# Altium schematic sheet BuckConverter.SchDoc
size A2; DrawnBy: Alexey Savchenko; Organization: Ring; Revision: 1.0
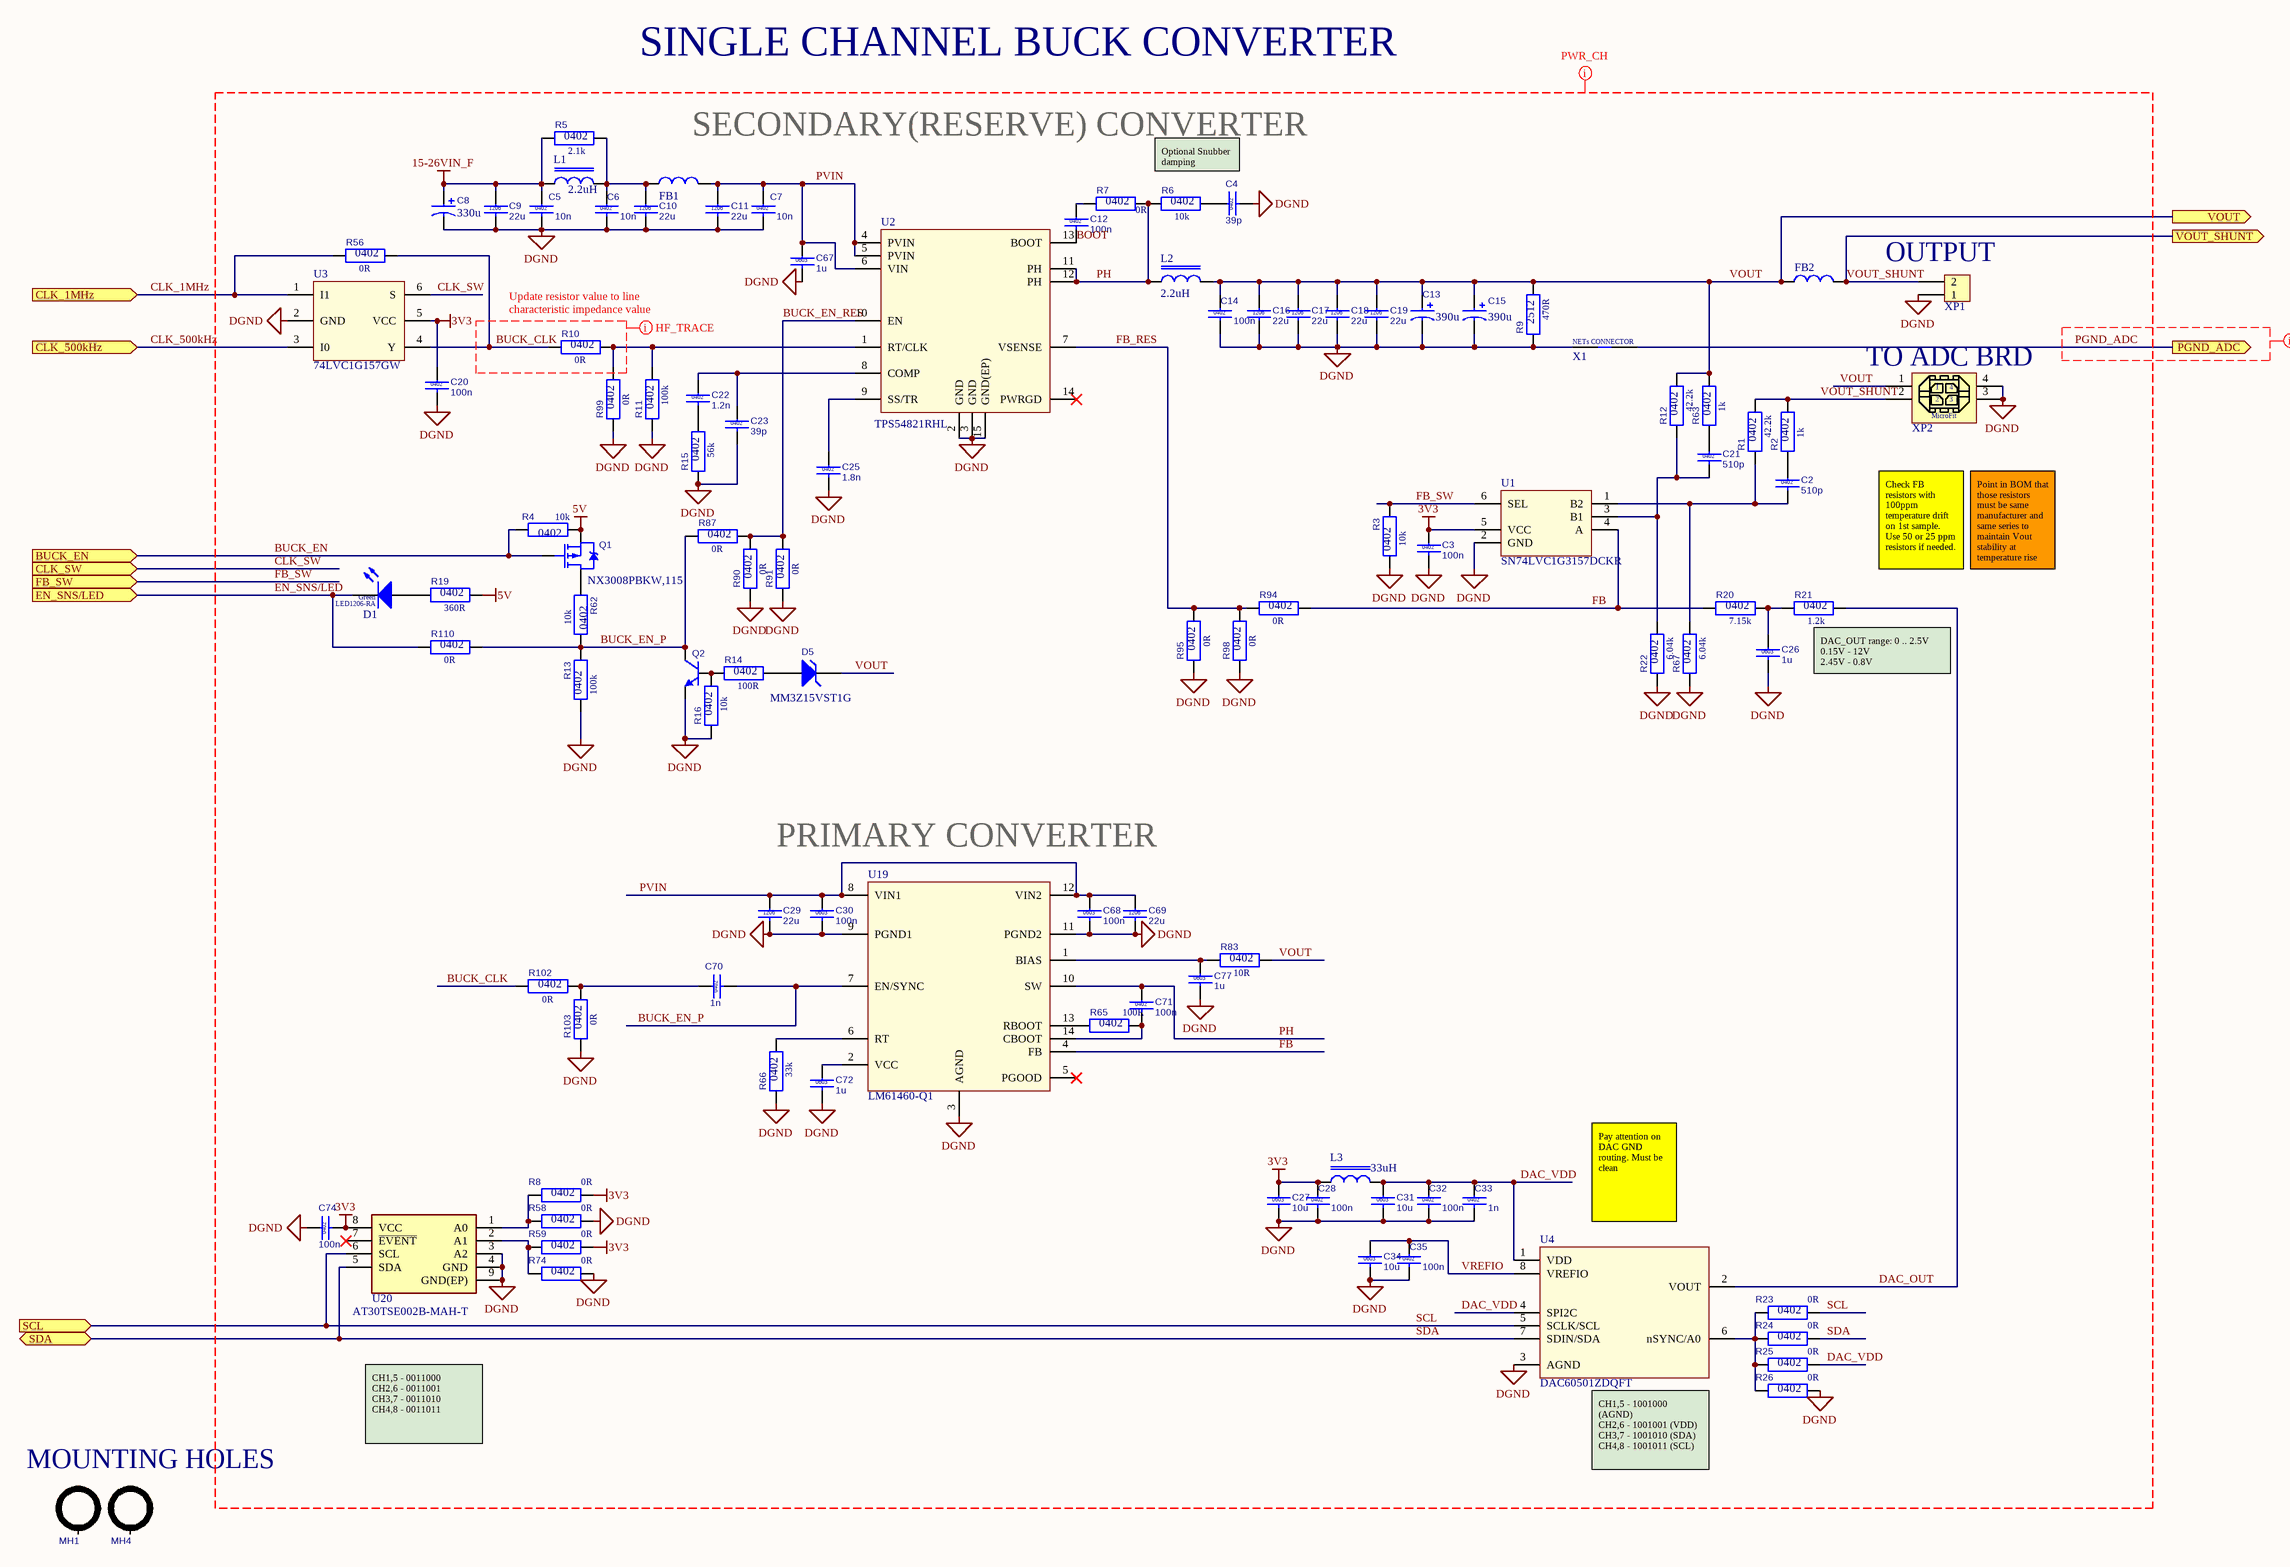
[diagram p0: BuckConverter.SchDoc]

## Parts
C2  510p  Case: 0402  [CC0402M]
C3  100n  Case: 0402  [CC0402M]
C4  39p  Case: 0402  [CC0402M]
C5  10n  Case: 0402  [CC0603M]
C6  10n  Case: 0402  [CC0603M]
C7  10n  Case: 0402  [CC0603M]
C8  330u  [CA-D10H10.5-SMD]
C9  22u  Case: 1206  [CC1206M]
C10  22u  Case: 1206  [CC1206M]
C11  22u  Case: 1206  [CC1206M]
C12  100n  Case: 0402  [CC0402M]
C13  390u  [CA-D8H12-SMD]
C14  100n  Case: 0402  [CC0402M]
C15  390u  [CA-D8H12-SMD]
C16  22u  Case: 1206  [CC1206M]
C17  22u  Case: 1206  [CC1206M]
C18  22u  Case: 1206  [CC1206M]
C19  22u  Case: 1206  [CC1206M]
C20  100n  Case: 0402  [CC0402M]
C21  510p  Case: 0402  [CC0402M]
C22  1.2n  Case: 0402  [CC0402M]
C23  39p  Case: 0402  [CC0402M]
C25  1.8n  Case: 0402  [CC0402M]
C26  1u  Case: 0603  [CC0603M]
C27  10u  Case: 0603  [CC0603M]
C28  100n  Case: 0402  [CC0402M]
C29  22u  Case: 1206  [CC1206M]
C30  100n  Case: 0603  [CC0603M]
C31  10u  Case: 0603  [CC0603M]
C32  100n  Case: 0402  [CC0402M]
C33  1n  Case: 0402  [CC0402M]
C34  10u  Case: 0603  [CC0603M]
C35  100n  Case: 0402  [CC0402M]
C67  1u  Case: 0603  [CC0603M]
C68  100n  Case: 0603  [CC0603M]
C69  22u  Case: 1206  [CC1206M]
C70  1n  Case: 0402  [CC0402M]
C71  100n  Case: 0402  [CC0402M]
C72  1u  Case: 0603  [CC0603M]
C74  100n  Case: 0402  [CC0402M]
C77  1u  Case: 0603  [CC0603M]
D1  Color: Green  [LED1206-RA]  (hidden comment: 155124GS73200A)
D5  MM3Z15VST1G  [SOD323]
FB1  BLM21SP601SH1D  [FB0805M]  (value not drawn)
FB2  BLM18KG260TN1D  [FB0603M]  (value not drawn)
L1  2.2uH  [MGV252010S]
L2  2.2uH  [104CDMCCDS]
L3  33uH  [IC0805-M]
MH1  MH-3.5-PLATED  [MH_3.5_PLATED]  (value not drawn)  (no BOM)
MH4  MH-3.5-PLATED  [MH_3.5_PLATED]  (value not drawn)  (no BOM)
Q1  NX3008PBKW,115  [SOT323]
Q2  NPN_transistor_SOT23-3  [SOT323]  (value not drawn)
R1  Case: 0402  [RC0402M]  (hidden comment: 42.2k)
R2  Case: 0402  [RC0402M]  (hidden comment: 1k)
R3  Case: 0402  [RC0402M]  (hidden comment: 10k)
R4  Case: 0402  [RC0402M]  (hidden comment: 10k)
R5  Case: 0402  [RC0402M]  (hidden comment: 2.1k)
R6  Case: 0402  [RC0402M]  (hidden comment: 10k)
R7  Case: 0402  [RC0402M]  (hidden comment: 0R)
R8  Case: 0402  [RC0402M]  (hidden comment: 0R)
R9  Case: 2512  [RC2512M]  (hidden comment: 470R)
R10  Case: 0402  [RC0402M]  (hidden comment: 0R)
R11  Case: 0402  [RC0402M]  (hidden comment: 100k)
R12  Case: 0402  [RC0402M]  (hidden comment: 42.2k)
R13  Case: 0402  [RC0402M]  (hidden comment: 100k)
R14  Case: 0402  [RC0402M]  (hidden comment: 100R)
R15  Case: 0402  [RC0402M]  (hidden comment: 56k)
R16  Case: 0402  [RC0402M]  (hidden comment: 10k)
R19  Case: 0402  [RC0402M]  (hidden comment: 360R)
R20  Case: 0402  [RC0402M]  (hidden comment: 7.15k)
R21  Case: 0402  [RC0402M]  (hidden comment: 1.2k)
R22  Case: 0402  [RC0402M]  (hidden comment: 6.04k)
R23  Case: 0402  [RC0402M]  (hidden comment: 0R)
R24  Case: 0402  [RC0402M]  (hidden comment: 0R)
R25  Case: 0402  [RC0402M]  (hidden comment: 0R)
R26  Case: 0402  [RC0402M]  (hidden comment: 0R)
R56  Case: 0402  [RC0402M]  (hidden comment: 0R)
R58  Case: 0402  [RC0402M]  (hidden comment: 0R)
R59  Case: 0402  [RC0402M]  (hidden comment: 0R)
R62  Case: 0402  [RC0402M]  (hidden comment: 10k)
R63  Case: 0402  [RC0402M]  (hidden comment: 1k)
R65  Case: 0402  [RC0402M]  (hidden comment: 100R)
R66  Case: 0402  [RC0402M]  (hidden comment: 33k)
R67  Case: 0402  [RC0402M]  (hidden comment: 6.04k)
R74  Case: 0402  [RC0402M]  (hidden comment: 0R)
R83  Case: 0402  [RC0402M]  (hidden comment: 10R)
R87  Case: 0402  [RC0402M]  (hidden comment: 0R)
R90  Case: 0402  [RC0402M]  (hidden comment: 0R)
R91  Case: 0402  [RC0402M]  (hidden comment: 0R)
R94  Case: 0402  [RC0402M]  (hidden comment: 0R)
R95  Case: 0402  [RC0402M]  (hidden comment: 0R)
R98  Case: 0402  [RC0402M]  (hidden comment: 0R)
R99  Case: 0402  [RC0402M]  (hidden comment: 0R)
R102  Case: 0402  [RC0402M]  (hidden comment: 0R)
R103  Case: 0402  [RC0402M]  (hidden comment: 0R)
R110  Case: 0402  [RC0402M]  (hidden comment: 0R)
U1  SN74LVC1G3157DCKR  [SOT363]
U2  TPS54821RHL  [VQFN-14]
U3  74LVC1G157GW  [SOT363]
U4  DAC60501ZDQFT  [WSON-8]
U19  LM61460-Q1  [VQFN-HR-14]
U20  AT30TSE002B-MAH-T  [WDFN-8]
X1  NETs_CONNECTOR  [NETs_CONNECTOR]  (value not drawn)  (no BOM)
XP1  TBH-2x3.81P-RA-GN  [TBH-2x3.81P-RA-GN]  (value not drawn)
XP2  0447690401  [0447690401]  (value not drawn)

## Ports
BUCK_EN (in), CLK_1MHz (in), CLK_500kHz (in), CLK_SW (in), EN_SNS/LED (in), FB_SW (in), PGND_ADC (out), SCL (in), SDA (bidir), VOUT (out), VOUT_SHUNT (out)

## Nets
3V3: C3.1 C20.1 C27.1 C28.1 C74.2 L3.1 R8.2 R59.2 U1.5(VCC) U3.5(VCC) U20.8(VCC)
5V: Q1.2(S) R4.2 R19.2
15-26VIN_F: C5.1 C8.1 C9.1 L1.1 R5.1
DGND: C3.2 C4.2 C5.2 C6.2 C7.2 C8.2 C9.2 C10.2 C11.2 C13.2 C14.2 C15.2 C16.2 C17.2 C18.2 C19.2 C20.2 C23.2 C25.2 C26.2 C27.2 C28.2 C29.2 C30.2 C31.2 C32.2 C33.2 C34.2 C35.2 C67.2 C68.2 C69.2 C72.2 C74.1 C77.2 Q2.2(E) R3.2 R9.1 R11.1 R13.2 R15.1 R16.1 R22.1 R26.2 R58.2 R66.1 R67.1 R74.2 R90.1 R91.1 R95.1 R98.1 R99.1 R103.1 U1.2(GND) U2.2(GND) U2.3(GND) U2.15(GND(EP)) U3.2(GND) U4.3(AGND) U19.3(AGND) U19.9(PGND1) U19.11(PGND2) U20.3(A2) U20.4(GND) U20.9(GND(EP)) X1.1 XP1.1 XP2.3 XP2.4
BOOT: C12.2 U2.13(BOOT)
BUCK_CLK: R10.1 R56.2 R102.1 U3.4(Y)
BUCK_EN: Q1.1(G) R4.1 ; port BUCK_EN
BUCK_EN_P: C70.2 Q2.3(C) R13.1 R62.2 R87.1 R110.2 U19.7(EN/SYNC)
BUCK_EN_RES: R87.2 R90.2 R91.2 U2.10(EN)
CLK_1MHz: R56.1 U3.1(I1) ; port CLK_1MHz
CLK_500kHz: U3.3(I0) ; port CLK_500kHz
CLK_SW: U3.6(S) ; port CLK_SW
DAC_OUT: R21.2 U4.2(VOUT)
DAC_VDD: C31.1 C32.1 C33.1 L3.2 R25.2 U4.1(VDD) U4.4(SPI2C)
EN_SNS/LED: D1.1(K) R110.1 ; port EN_SNS/LED
FB: R20.1 R94.2 U1.4(A) U19.4(FB)
FB_RES: R94.1 R95.2 R98.2 U2.7(VSENSE)
FB_SW: R3.1 U1.6(SEL) ; port FB_SW
PGND_ADC: X1.2 ; port PGND_ADC
PH: C71.1 L2.1 R6.1 R7.2 U2.11(PH) U2.12(PH) U19.10(SW)
PVIN: C7.1 C11.1 C29.1 C30.1 C67.1 C68.1 C69.1 FB1.2 U2.4(PVIN) U2.5(PVIN) U2.6(VIN) U19.8(VIN1) U19.12(VIN2)
SCL: R23.2 U4.5(SCLK/SCL) U20.6(SCL) ; port SCL
SDA: R24.2 U4.7(SDIN/SDA) U20.5(SDA) ; port SDA
VOUT: C13.1 C14.1 C15.1 C16.1 C17.1 C18.1 C19.1 D5.1(K) FB2.1 L2.2 R9.2 R12.2 R63.2 R83.2 XP2.1 ; port VOUT
VOUT_SHUNT: FB2.2 R1.2 R2.2 XP1.2 XP2.2 ; port VOUT_SHUNT
VREFIO: C34.1 C35.1 U4.8(VREFIO)
NetC2_1: C2.1 R2.1
NetC2_2: C2.2 R1.1 R67.2 U1.1(B2)
NetC4_1: C4.1 R6.2
NetC6_1: C6.1 C10.1 FB1.1 L1.2 R5.2
NetC12_1: C12.1 R7.1
NetC21_1: C21.1 R63.1
NetC21_2: C21.2 R12.1 R22.2 U1.3(B1)
NetC22_1: C22.1 C23.1 U2.8(COMP)
NetC22_2: C22.2 R15.2
NetC25_1: C25.1 U2.9(SS/TR)
NetC26_1: C26.1 R20.2 R21.1
NetC70_1: C70.1 R102.2 R103.2
NetC71_2: C71.2 R65.2 U19.14(CBOOT)
NetC72_1: C72.1 U19.2(VCC)
NetC77_1: C77.1 R83.1 U19.1(BIAS)
NetD1_2: D1.2(A) R19.1
NetD5_2: D5.2(A) R14.2
NetQ1_3: Q1.3(D) R62.1
NetQ2_1: Q2.1(B) R14.1 R16.2
NetR8_1: R8.1 R58.1 U20.1(A0)
NetR10_2: R10.2 R11.2 R99.2 U2.1(RT/CLK)
NetR23_1: R23.1 R24.1 R25.1 R26.1 U4.6(nSYNC/A0)
NetR59_1: R59.1 R74.1 U20.2(A1)
NetR65_1: R65.1 U19.13(RBOOT)
NetR66_2: R66.2 U19.6(RT)

Not connected (* = marked no-connect by the designer): MH1 0; MH4 0; U2 14(PWRGD)*; U19 5(PGOOD)*; U20 7(~{EVENT})*

## Layout directives
net class PWR_CH: 3V3, 5V, 15-26VIN_F, BOOT, BUCK_CLK, BUCK_EN, BUCK_EN_P, BUCK_EN_RES, CLK_SW, DAC_OUT, DAC_VDD, DGND, EN_SNS/LED, FB, FB_RES, FB_SW, PGND_ADC, PH, PVIN, SCL, SDA, VOUT, VOUT_SHUNT, VREFIO
net class PGND_ADC: PGND_ADC
net class HF_TRACE: BUCK_CLK

## Notes on the sheet
- SINGLE CHANNEL BUCK CONVERTER
- SECONDARY(RESERVE) CONVERTER
- Optional Snubber damping
- (near XP1) OUTPUT
- (near R10) Update resistor value to line characteristic impedance value
- (near XP2) TO ADC BRD
- Check FB resistors with 100ppm temperature drift on 1st sample. Use 50 or 25 ppm resistors if needed.
- Point in BOM that those resistors must be same manufacturer and same series to maintain Vout stability at temperature rise
- (near R21) DAC_OUT range: 0 .. 2.5V
  0.15V - 12V
  2.45V - 0.8V
- PRIMARY CONVERTER
- (near U4) Pay attention on DAC GND routing. Must be clean
- CH1,5 - 0011000
  CH2,6 - 0011001
  CH3,7 - 0011010
  CH4,8 - 0011011
- MOUNTING HOLES
- (near U4) CH1,5 - 1001000 (AGND)
  CH2,6 - 1001001 (VDD)
  CH3,7 - 1001010 (SDA)
  CH4,8 - 1001011 (SCL)
- (in symbol 0447690401) MicroFit
- (in symbol NETs_CONNECTOR) NETs CONNECTOR

## Library data of the parts
C2 C21 = CC0402J-NP0-50V-510P-M: Chip ceramic capacitor; Manufacturer PN: 0402N511J500CT; Manufacturer: Walsin; Tollerance: 5%; Rated Voltage: 50V; Material: NP0; PartNumber: CC0402J-NP0-50V-510P-M; Value: 510p; Publisher: alexey.savchenko; Publishing Date: 3/16/2020
C3 C12 C14 C20 C28 C32 C35 C71 C74 = CC0402K-X7R-25V-100N-M: Chip ceramic capacitor; Manufacturer PN: GRM155R71E104KE14J; Manufacturer: Murata; Tollerance: 10%; Rated Voltage: 25V; Material: X7R; PartNumber: CC0402K-X7R-25V-100N-M; Value: 100n; Publisher: alexey.savchenko; Publishing Date: 1/12/2020
C4 C23 = CC0402J-NP0-50V-39P-M: Chip ceramic capacitor; Manufacturer PN: CC0402JRNPO9BN390; Manufacturer: Yageo; Tollerance: 5%; Rated Voltage: 50V; Material: NP0; PartNumber: CC0402J-NP0-50V-39P-M; Value: 39p; Publisher: alexey.savchenko; Publishing Date: 2/27/2020
C5-C7 = CC0402K-X7R-50V-10N-M: Chip ceramic capacitor; Manufacturer PN: CC0402KRX7R9BB103; Manufacturer: Yageo; Tollerance: 10%; Rated Voltage: 50V; Material: X7R; PartNumber: CC0402K-X7R-50V-10N-M; Value: 10n; Publisher: alexey.savchenko; Publishing Date: 2/27/2020
C8 = CE-L10D10-330U-35V-SMD: Aluminium Electrlytic capacitor; Manufacturer PN: EXV337M035A9PAA; Manufacturer: Kemet; Tollerance: 20%; Rated Voltage: 35V; ESR: 120m; Value: 330u; PartNumber: CE-L10D10-330U-35V-SMD; Publisher: alexey.savchenko; Publishing Date: 3/30/2020
C9-C11 C29 C69 = CC1206K-X5R-35V-22U-M: Chip ceramic capacitor; Manufacturer PN: C3216X5R1V226M160AC; Manufacturer: TDK; Tollerance: 10%; Rated Voltage: 35V; Material: X5R; PartNumber: CC1206K-X5R-35V-22U-M; Value: 22u; Publisher: alexey.savchenko; Publishing Date: 3/30/2020
C13 C15 = 20SVPF390M: Aluminium polymer capacitor; Manufacturer: Panasonic; Tollerance: 20%; Rated Voltage: 20V; ESR: 14m; Value: 390u; PartNumber: 20SVPF390M; Manufacturer PN: 20SVPF390M; Publisher: alexey.savchenko; Publishing Date: 1/12/2020
C16-C19 = CC1206K-X5R-25V-22U-M: Chip ceramic capacitor; Manufacturer PN: CL31A226KAHNNNE; Manufacturer: Samsung; Tollerance: 10%; Rated Voltage: 25V; Material: X5R; PartNumber: CC1206K-X5R-25V-22U-M; Value: 22u; Publisher: alexey.savchenko; Publishing Date: 1/12/2020
C22 = CC0402K-X7R-50V-1N2-M: Chip ceramic capacitor; Manufacturer PN: CC0402KRX7R9BB122; Manufacturer: Yageo; Tollerance: 10%; Rated Voltage: 50V; Material: X7R; PartNumber: CC0402K-X7R-50V-1N2-M; Value: 1.2n; Publisher: alexey.savchenko; Publishing Date: 2/27/2020
C25 = CC0402K-X7R-50V-1N8-M: Chip ceramic capacitor; Manufacturer: Yageo; Manufacturer PN: CC0402KRX7R9BB182; Tollerance: 10%; Rated Voltage: 50V; Material: X7R; PartNumber: CC0402K-X7R-50V-1N8-M; Value: 1.8n; Publisher: alexey.savchenko; Publishing Date: 2/27/2020
C26 = CC0603K-X7R-10V-1U-M: Chip ceramic capacitor; Manufacturer PN: CL10B105KP8NNNC; Manufacturer: Samsung; Tollerance: 10%; Rated Voltage: 10V; Material: X5R; PartNumber: CC0603K-X7R-10V-1U-M; Value: 1u; Publisher: alexey.savchenko; Publishing Date: 1/12/2020
C27 C31 C34 = CC0603K-X5R-10V-10U-M: Chip ceramic capacitor; Manufacturer PN: GRM188R61A106KE69D; Manufacturer: Murata; Tollerance: 10%; Rated Voltage: 10V; Material: X5R; PartNumber: CC0603K-X5R-10V-10U-M; Value: 10u; Publisher: alexey.savchenko; Publishing Date: 1/12/2020
C30 C68 = CC0603K-X7R-50V-100N-M: Chip ceramic capacitor; Manufacturer PN: CC0603KRX7R9BB104; Manufacturer: Yageo; Tollerance: 10%; Rated Voltage: 50V; Material: X7R; PartNumber: CC0603K-X7R-50V-100N-M; Value: 100n; Publisher: alexey.savchenko; Publishing Date: 1/12/2020
C33 C70 = CC0402K-X7R-50V-1N-M: Chip ceramic capacitor; Manufacturer PN: CC0402KRX7R9BB102; Manufacturer: Yageo; Tollerance: 10%; Rated Voltage: 50V; Material: X7R; PartNumber: CC0402K-X7R-50V-1N-M; Value: 1n; Publisher: alexey.savchenko; Publishing Date: 2/27/2020
C67 C72 C77 = CC0603K-X5R-50V-1U-M: Chip ceramic capacitor; Manufacturer PN: CL10A105KB8NNNC; Manufacturer: Samsung; Tollerance: 10%; Rated Voltage: 50V; Material: X5R; PartNumber: CC0603K-X5R-50V-1U-M; Value: 1u; Publisher: alexey.savchenko; Publishing Date: 1/12/2020
D1 = 155124GS73200A: LED GREEN CLEAR 1206 SMD RA; Manufacturer: Würth Elektronik; Case: LED1206-RA; PartNumber: 155124GS73200A; Manufacturer PN: 155124GS73200A; Publisher: alexey.savchenko; Publishing Date: 3/31/2020
D5 = MM3Z15VST1G: Zener Diode 14.66V 300mW ±2% Surface Mount SOD-323; Manufacturer: ON Semiconductor; PartNumber: MM3Z15VST1G; Manufacturer PN: MM3Z15VST1G; Case: SOD323; Publisher: alexey.savchenko; Publishing Date: 4/9/2020
FB1 = BLM21SP601SH1D: 600 Ohms @ 100MHz 1 Power Line Ferrite Bead 0805 (2012 Metric) 2.3A; Manufacturer: Murata; Resistance: 600; PartNumber: BLM21SP601SH1D; Manufacturer PN: BLM21SP601SH1D; Publisher: alexey.savchenko; Publishing Date: 2/17/2020
FB2 = BLM18KG260TN1D: 26 Ohms @ 100MHz 1 Power Line Ferrite Bead 0603 (1608 Metric) 6A 7mOhm; Manufacturer: Murata; Resistance: 26; PartNumber: BLM18KG260TN1D; Manufacturer PN: BLM18KG260TN1D; Publisher: alexey.savchenko; Publishing Date: 1/12/2020
L1 = MGV252010S2R2M-10: 2.2µH Shielded Molded Inductor 2.4A 110mOhm Max 1008 (2520 Metric); Manufacturer: Laird-Signal Integrity Products; Tollerance: 20%; PartNumber: MGV252010S2R2M-10; Manufacturer PN: MGV252010S2R2M-10; Value: 2.2uH; Publisher: alexey.savchenko; Publishing Date: 4/1/2020
L2 = 104CDMCCDS-2R2MC: FIXED IND 2.2UH 15A 7 MOHM; Manufacturer: Sumida; Tollerance: 20%; PartNumber: 104CDMCCDS-2R2MC; Manufacturer PN: 104CDMCCDS-2R2MC; Value: 2.2uH; Publisher: alexey.savchenko; Publishing Date: 1/12/2020
L3 = CV201210-330K: FIXED IND 33UH 5MA 1.25 OHM SMD; Manufacturer: Bourns; Tollerance: 10%; PartNumber: CV201210-330K; Manufacturer PN: CV201210-330K; Value: 33uH; Publisher: alexey.savchenko; Publishing Date: 2/17/2020
MH1 MH4 = MH-3.5-PLATED: Mounting Hole; Manufacturer PN: NULL; PartNumber: MH-3.5-PLATED; Manufacturer: NULL; Publisher: alexey.savchenko; Publishing Date: 3/25/2020
Q1 = NX3008PBKW,115: P-Channel 30V 200mA (Ta) 260mW (Ta), 830mW (Tc) Surface Mount SC-70; Manufacturer: Nexperia; PartNumber: NX3008PBKW,115; Manufacturer PN: NX3008PBKW,115; Case: SOT323; Publisher: alexey.savchenko; Publishing Date: 4/9/2020
Q2 = MMBT3904WT1G: TRANS NPN 40V 0.2A SOT323; Manufacturer: ON Semiconductor; PartNumber: MMBT3904WT1G; Manufacturer PN: MMBT3904WT1G; Case: SOT323; Publisher: alexey.savchenko; Publishing Date: 4/9/2020
R1 R12 = RC0402F-42K2-M: Chip resistor; Manufacturer PN: RC0402FR-0742K2L; Manufacturer: Yageo; Tollerance: 1%; Rated Voltage: 50V; Power: 0.063W; T Coefficient: 100ppm; Value: 42.2k; PartNumber: RC0402F-42K2-M; Publisher: alexey.savchenko; Publishing Date: 2/24/2020
R2 R63 = RC0402F-1K-M: Chip resistor; Manufacturer PN: RC0402FR-071KL; Manufacturer: Yageo; Tollerance: 1%; Rated Voltage: 50V; Power: 0.063W; T Coefficient: 100ppm; Value: 1k; PartNumber: RC0402F-1K-M; Publisher: alexey.savchenko; Publishing Date: 2/24/2020
R3 R4 R6 R16 R62 = RC0402F-10K-M: Chip resistor; Manufacturer PN: RC0402FR-0710KL; Manufacturer: Yageo; Tollerance: 1%; Rated Voltage: 50V; Power: 0.063W; T Coefficient: 100ppm; Value: 10k; PartNumber: RC0402F-10K-M; Publisher: alexey.savchenko; Publishing Date: 2/24/2020
R5 = RC0402F-2K1-M: Chip resistor; Manufacturer PN: RC0402FR-072K1L; Manufacturer: Yageo; Tollerance: 1%; Rated Voltage: 50V; Power: 0.063W; T Coefficient: 100ppm; Value: 2.1k; PartNumber: RC0402F-2K1-M; Publisher: alexey.savchenko; Publishing Date: 2/24/2020
R7 R8 R10 R23-R26 R56 R58 R59 R74 R87 R90 R91 R94 R95 R98 R99 R102 R103 R110 = RC0402F-0R-M: Chip resistor; Manufacturer PN: RC0402FR-070RL; Manufacturer: Yageo; Tollerance: 1%; Rated Voltage: 50V; Power: 0.063W; Value: 0R; PartNumber: RC0402F-0R-M; Publisher: alexey.savchenko; Publishing Date: 2/24/2020
R9 = RC2512J-479R-M: Chip resistor; Manufacturer PN: RMCF2512JT470R; Manufacturer: Stackpole; Tollerance: 5%; Rated Voltage: 200V; Power: 1W; T Coefficient: 200ppm; Value: 470R; PartNumber: RC2512J-479R-M; Publisher: alexey.savchenko; Publishing Date: 2/24/2020
R11 R13 = RC0402F-100K-M: Chip resistor; Manufacturer PN: RC0402FR-07100KL; Manufacturer: Yageo; Tollerance: 1%; Rated Voltage: 50V; Power: 0.063W; T Coefficient: 100ppm; Value: 100k; PartNumber: RC0402F-100K-M; Publisher: alexey.savchenko; Publishing Date: 2/24/2020
R14 R65 = RC0402F-100R-M: Chip resistor; Manufacturer PN: RC0402FR-07100RL; Manufacturer: Yageo; Tollerance: 1%; Rated Voltage: 50V; Power: 0.063W; Value: 100R; PartNumber: RC0402F-100R-M; Publisher: alexey.savchenko; Publishing Date: 2/24/2020
R15 = RC0402F-56K-M: Chip resistor; Manufacturer PN: RC0402FR-0756KL; Manufacturer: Yageo; Tollerance: 1%; Rated Voltage: 50V; Power: 0.063W; T Coefficient: 100ppm; Value: 56k; PartNumber: RC0402F-56K-M; Publisher: alexey.savchenko; Publishing Date: 2/24/2020
R19 = RC0402F-360R-M: Chip resistor; Manufacturer PN: RC0402FR-07360RL; Manufacturer: Yageo; Tollerance: 1%; Rated Voltage: 50V; Power: 0.063W; Value: 360R; PartNumber: RC0402F-360R-M; Publisher: alexey.savchenko; Publishing Date: 2/24/2020
R20 = RC0402F-7K15-M: Chip resistor; Manufacturer PN: RC0402FR-077K15L; Manufacturer: Yageo; Tollerance: 1%; Rated Voltage: 50V; Power: 0.063W; T Coefficient: 100ppm; Value: 7.15k; PartNumber: RC0402F-7K15-M; Publisher: alexey.savchenko; Publishing Date: 2/24/2020
R21 = RC0402F-1K2-M: Chip resistor; Manufacturer PN: RC0402FR-071K2L; Manufacturer: Yageo; Tollerance: 1%; Rated Voltage: 50V; Power: 0.063W; T Coefficient: 100ppm; Value: 1.2k; PartNumber: RC0402F-1K2-M; Publisher: alexey.savchenko; Publishing Date: 2/24/2020
R22 R67 = RC0402F-6K04-M: Chip resistor; Manufacturer PN: RC0402FR-076K04L; Manufacturer: Yageo; Tollerance: 1%; Rated Voltage: 50V; Power: 0.063W; T Coefficient: 100ppm; Value: 6.04k; PartNumber: RC0402F-6K04-M; Publisher: alexey.savchenko; Publishing Date: 2/24/2020
R66 = RC0402F-33K-M: Chip resistor; Manufacturer PN: RC0402FR-0733KL; Manufacturer: Yageo; Tollerance: 1%; Rated Voltage: 50V; Power: 0.063W; T Coefficient: 100ppm; Value: 33k; PartNumber: RC0402F-33K-M; Publisher: alexey.savchenko; Publishing Date: 2/24/2020
R83 = RC0402F-10R-M: Chip resistor; Manufacturer PN: RC0402FR-0710RL; Manufacturer: Yageo; Tollerance: 1%; Rated Voltage: 50V; Power: 0.063W; Value: 10R; PartNumber: RC0402F-10R-M; Publisher: alexey.savchenko; Publishing Date: 2/24/2020
U1 = SN74LVC1G3157DCKR: 1 Circuit IC Switch 2:1 10Ohm SOT-363; Manufacturer: TI; Analogs: 74LVC1G3157DW-7(Diodes), PI5A3157CEX(Diodes); PartNumber: SN74LVC1G3157DCKR; Manufacturer PN: SN74LVC1G3157DCKR; Case: SOT363; Publisher: alexey.savchenko; Publishing Date: 4/9/2020
U2 = TPS54821RHL: IC REG BUCK ADJUSTABLE 8A 14VQFN; Manufacturer: TI; PartNumber: TPS54821RHL; Manufacturer PN: TPS54821RHL; Case: VQFN14; Publisher: alexey.savchenko; Publishing Date: 1/12/2020
U3 = 74LVC1G157GW: IC SINGLE 2-INPUT MUX 6TSSOP; Manufacturer: Nexperia; Analogs: NC7SV157P6X,NC7SZ157P6X; PartNumber: 74LVC1G157GW; Manufacturer PN: 74LVC1G157GW; Case: SOT363; Publisher: alexey.savchenko; Publishing Date: 1/21/2020
U4 = DAC60501ZDQFT: SINGLE CHAN DAC 24BIT- ZEROCODE; Manufacturer: TI; Analogs: DAC60501MDQFR, DAC60501MDQFT, DAC60501ZDQFR; PartNumber: DAC60501ZDQFT; Manufacturer PN: DAC60501ZDQFT; Case: WSON-8; Publisher: alexey.savchenko; Publishing Date: 1/13/2020
U19 = LM61460-Q1: Buck Switching Regulator IC Positive Adjustable 1V 1 Output 6A 14-VFQFN; Manufacturer PN: LM61460AASQRJRRQ1; Manufacturer: TI; PartNumber: LM61460-Q1; Case: VQFN-HR-14; Publisher: alexey.savchenko; Publishing Date: 3/27/2020
U20 = AT30TSE002B-MAH-T: Temperature Sensor Digital, Local -20°C ~ 125°C 10 b 8-WDFN (2x3); Manufacturer: Microchip; PartNumber: AT30TSE002B-MAH-T; Manufacturer PN: AT30TSE002B-MAH-T; Case: WDFN-8; Publisher: alexey.savchenko; Publishing Date: 3/31/2020
X1 = NETs_CONNECTOR: No BOM component to short circuit 2 nets; Manufacturer PN: NULL; PartNumber: NETs_CONNECTOR; Manufacturer: NULL; Publisher: alexey.savchenko; Publishing Date: 2/14/2020
XP1 = TBH-2x3.81P-RA-GN: 2 Position Terminal Block Header, Male Pins, Shrouded (4 Side) 0.150" (3.81mm) 90°, Right Angle Through Hole; Manufacturer PN: 691322310002+691361300002(Plug); Manufacturer: Würth Elektronik; PartNumber: TBH-2x3.81P-RA-GN; Publisher: alexey.savchenko; Publishing Date: 2/14/2020
XP2 = 0447690401: Micro-Fit BMI Receptacle Header, Dual Row, Vertical, with Press-fit Plastic Pegs, 2.54µm Tin (Sn), 4 Circuits; Manufacturer: Molex; Analogs: 0447690402, 0447690403; PartNumber: 0447690401; Manufacturer PN: 0447690401; Publisher: alexey.savchenko; Publishing Date: 2/14/2020